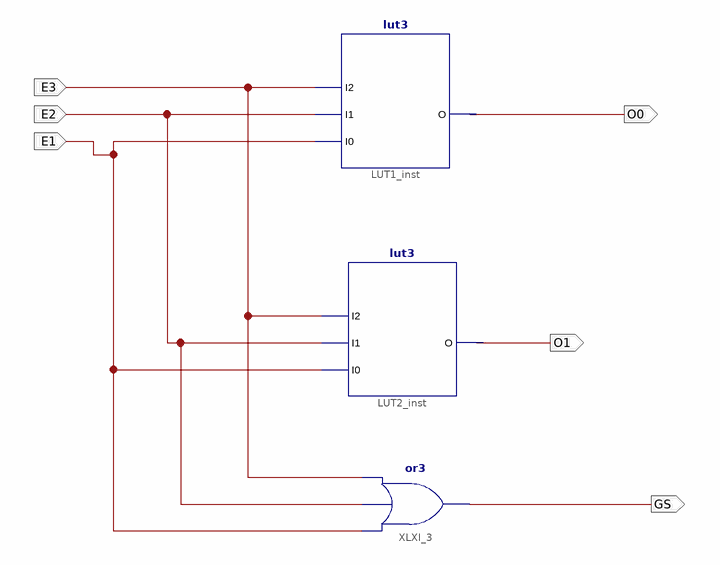
[diagram p0: schematic sheet 1]
// Xilinx ISE schematic encodeur_sc.sch (spartan6) as structural Verilog: 3 symbols, 6 ports
module encodeur_sc (
  input  E3,
  input  E2,
  input  E1,
  output O0,
  output O1,
  output GS
);

  lut3 #(.INIT("44")) LUT1_inst (.I0(E1), .I1(E2), .I2(E3), .O(O0));
  lut3 #(.INIT("10")) LUT2_inst (.I0(E1), .I1(E2), .I2(E3), .O(O1));
  or XLXI_3 (GS, E1, E2, E3);
endmodule
